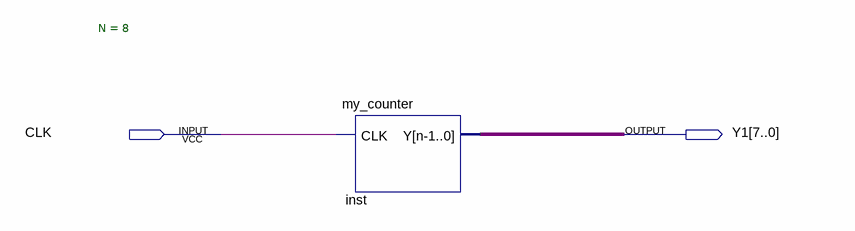
[diagram p0: schematic sheet]
// Quartus schematic behavioural.bdf as structural Verilog: 1 symbols, 2 pins
module behavioural (
  input  CLK,
  output [7:0] Y1
);

  my_counter #(.N(8)) inst (.CLK(CLK), .Y(Y1));
endmodule
